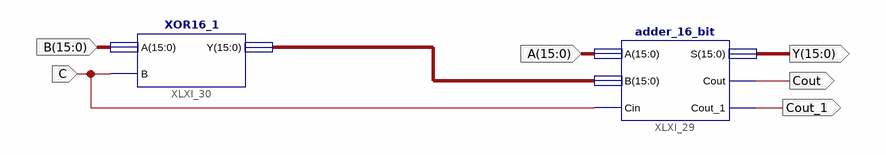
[diagram p0: schematic sheet 1]
// Xilinx ISE schematic two_comple_adder_16bit.sch (virtex6) as structural Verilog: 2 symbols, 6 ports
module two_comple_adder_16bit (
  input  [15:0] A,
  input  [15:0] B,
  input  C,
  output [15:0] Y,
  output Cout,
  output Cout_1
);

  wire [15:0] XLXN_5;

  adder_16_bit XLXI_29 (.A(A), .B(XLXN_5), .Cin(C), .Cout(Cout), .Cout_1(Cout_1), .S(Y));
  XOR16_1 XLXI_30 (.A(B), .B(C), .Y(XLXN_5));
endmodule
